# Altium schematic sheet Thermocouple.SchDoc
size Letter
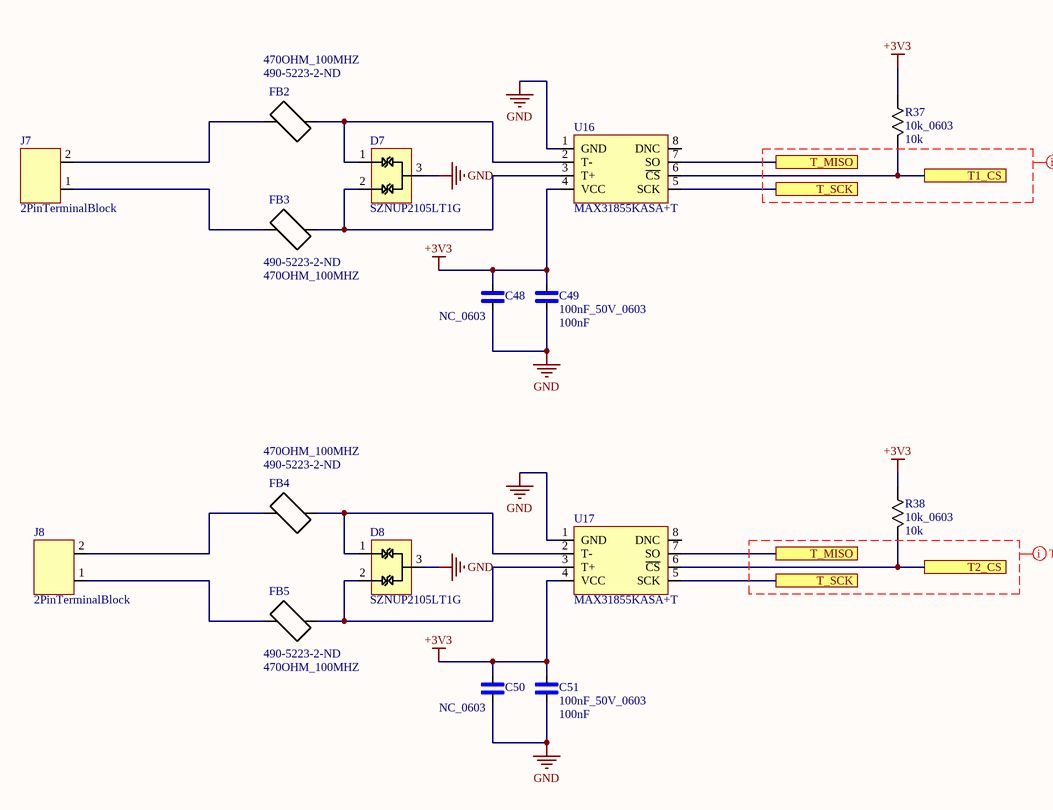
[diagram p0: Thermocouple.SchDoc]

## Parts
C48  NC_0603  [0603]
C49  100nF_50V_0603  Capacitance: 100nF  [0603]
C50  NC_0603  [0603]
C51  100nF_50V_0603  Capacitance: 100nF  [0603]
D7  SZNUP2105LT1G  [SOT-23-3]
D8  SZNUP2105LT1G  [SOT-23-3]
FB2  470OHM_100MHZ  Supplier Part Number 1: 490-5223-2-ND  [0603]
FB3  470OHM_100MHZ  Supplier Part Number 1: 490-5223-2-ND  [0603]
FB4  470OHM_100MHZ  Supplier Part Number 1: 490-5223-2-ND  [0603]
FB5  470OHM_100MHZ  Supplier Part Number 1: 490-5223-2-ND  [0603]
J7  2PinTerminalBlock  [2 Pos 2.54mm Pitch]
J8  2PinTerminalBlock  [2 Pos 2.54mm Pitch]
R37  10k_0603  Resistance: 10k  [0603]
R38  10k_0603  Resistance: 10k  [0603]
U16  MAX31855KASA+T  [MAX31855KASA+T]
U17  MAX31855KASA+T  [MAX31855KASA+T]

## Ports
T1_CS, T2_CS, T_MISO, T_SCK

## Nets
+3V3: C48.2 C49.2 C50.2 C51.2 R37.2 R38.2 U16.4(VCC) U17.4(VCC)
GND: C48.1 C49.1 C50.1 C51.1 D7.3 D8.3 U16.1(GND) U17.1(GND)
T1_CS: R37.1 U16.6(~{CS}) ; port T1_CS
T2_CS: R38.1 U17.6(~{CS}) ; port T2_CS
T_MISO: U16.7(SO) U17.7(SO) ; port T_MISO
T_SCK: U16.5(SCK) U17.5(SCK) ; port T_SCK
NetD7_1: D7.1 FB2.2 U16.2(T-)
NetD7_2: D7.2 FB3.2 U16.3(T+)
NetD8_1: D8.1 FB4.2 U17.2(T-)
NetD8_2: D8.2 FB5.2 U17.3(T+)
NetFB2_1: FB2.1 J7.2
NetFB3_1: FB3.1 J7.1
NetFB4_1: FB4.1 J8.2
NetFB5_1: FB5.1 J8.1

Not connected (* = marked no-connect by the designer): U16 8(DNC); U17 8(DNC)

## Layout directives
net class TCOUPLENETS: (no net found under the mark)

## Library data of the parts
C49 C51 = 100nF_50V_0603: Manufacturer: Murata; Manufacturer Part Number: GRM188R71H104KA93D; Material: Ceramic; Tolerance: 10%; Voltage Rating: 50V; Dielectric: X7R; Insulation Resistance: 10GR; Supplier 1: Digi-Key; Stock 1: 0; Pricing 1: 1=0.12, 10=0.084, 100=0.0396, 500=0.02778, 1000=0.023 (USD); Mount: Surface Mount; Case/Package: 0603; Number of Pins: 2; Case Code (Imperial): 0603; Case Code (Metric): 1608; Dielectric Material: Ceramic; Contact Plating: Tin,Matte; Min Operating Temperature: -55°C; Max Operating Temperature: 125°C; Packaging: Tape and Reel; Voltage Rating (DC): 50V; Package Quantity: 1; Termination: SMD/SMT; Voltage: 50V; Length: 1.6mm; Height: 0.8mm; Width: 0.8mm; Thickness: 0.035inch; Depth: 0.8mm; Radiation Hardening: No; REACH SVHC: No SVHC; Lead Free: Lead Free; ComponentLink1URL: https://datasheet.ciiva.com/19467/1857604-19467681.pdf; ComponentLink1Description: https://datasheet.ciiva.com/19467/1857604-19467681.pdf; ComponentLink2URL: https://datasheet.ciiva.com/28534/4360-28534245.pdf; ComponentLink2Description: https://datasheet.ciiva.com/28534/4360-28534245.pdf; ComponentLink3URL: https://datasheet.ciiva.com/26915/getdatasheetpartid-89095-26915384.pdf; ComponentLink3Description: https://datasheet.ciiva.com/26915/getdatasheetpartid-89095-26915384.pdf; ComponentLink4URL: https://datasheet.ciiva.com/131/partnumbering-e-01-131738.pdf; ComponentLink4Description: https://datasheet.ciiva.com/131/partnumbering-e-01-131738.pdf; ComponentLink5URL: https://datasheet.ciiva.com/7937/1747470-7937658.pdf; ComponentLink5Description: https://datasheet.ciiva.com/7937/1747470-7937658.pdf; ComponentLink6URL: https://datasheet.ciiva.com/14116/nmgrm-data-en-14116602.pdf; ComponentLink6Description: https://datasheet.ciiva.com/14116/nmgrm-data-en-14116602.pdf; ComponentLink7URL: https://datasheet.ciiva.com/131/partnumbering-e-01-131739.pdf; ComponentLink7Description: https://datasheet.ciiva.com/131/partnumbering-e-01-131739.pdf; ComponentLink8URL: https://datasheet.ciiva.com/7937/4360-7937659.pdf; ComponentLink8Description: https://datasheet.ciiva.com/7937/4360-7937659.pdf; ComponentLink9URL: https://datasheet.ciiva.com/48436/nmgrm-data-en-48436667.pdf; ComponentLink9Description: https://datasheet.ciiva.com/48436/nmgrm-data-en-48436667.pdf; ComponentLink10URL: https://datasheet.ciiva.com/131/partnumbering-e-01-131740.pdf; ComponentLink10Description: https://datasheet.ciiva.com/131/partnumbering-e-01-131740.pdf; ComponentLink11URL: https://datasheet.ciiva.com/11786/0900766b807a1cab-11786047.pdf; ComponentLink11Description: https://datasheet.ciiva.com/11786/0900766b807a1cab-11786047.pdf; ComponentLink12URL: https://datasheet.ciiva.com/29201/451744-da-01-en-vs-kondensator-0603-29201904.pdf; ComponentLink12Description: https://datasheet.ciiva.com/29201/451744-da-01-en-vs-kondensator-0603-29201904.pdf; Supplier Part Number 1: 490-1519-6-ND
FB2-FB5 = 470OHM_100MHZ: Manufacturer: Murata; Manufacturer Part Number: BLM18PG471SN1D; Core Material: Ferrite; Material: Steel,Ferrite; Tolerance: 25%; Impedance: 470R; Resistance: 200mR; Current Rating: 1A; Test Frequency: 100MHz; Number of Lines: 1; Supplier 1: Digi-Key; Stock 1: 328000; Pricing 1: 4000=0.02208, 8000=0.02001, 12000=0.01932, 28000=0.01794, 100000=0.01773 (USD); Case/Package: 0603; Number of Pins: 2; Case Code (Metric): 1608; Case Code (Imperial): 0603; Min Operating Temperature: -55°C; Max Operating Temperature: 125°C; Package Quantity: 1; Packaging: Tape and Reel; Max Current Rating: 1A; Max DC Current: 1A; DC Resistance (DCR): 200mR; Termination: SMD/SMT; DC Current: 1A; Military Standard: Not; Number of Circuits: 1; Length: 1.6mm; Height: 0.8mm; Width: 0.8mm; Depth: 0.8mm; Radiation Hardening: No; REACH SVHC: No SVHC; Lead Free: Lead Free; ComponentLink1URL: https://datasheet.ciiva.com/11800/0900766b81275ca5-11800885.pdf; ComponentLink1Description: https://datasheet.ciiva.com/11800/0900766b81275ca5-11800885.pdf; ComponentLink2URL: https://datasheet.ciiva.com/16331/l0110s0100blm18p-16331542.pdf; ComponentLink2Description: https://datasheet.ciiva.com/16331/l0110s0100blm18p-16331542.pdf; ComponentLink3URL: https://datasheet.ciiva.com/8021/1740433-8021497.pdf; ComponentLink3Description: https://datasheet.ciiva.com/8021/1740433-8021497.pdf; ComponentLink4URL: https://datasheet.ciiva.com/6212/l0110s0100blm18p-6212506.pdf; ComponentLink4Description: https://datasheet.ciiva.com/6212/l0110s0100blm18p-6212506.pdf; ComponentLink5URL: https://datasheet.ciiva.com/8021/1740433-8021498.pdf; ComponentLink5Description: https://datasheet.ciiva.com/8021/1740433-8021498.pdf; ComponentLink6URL: https://datasheet.ciiva.com/6212/l0110s0100blm18p-6212508.pdf; ComponentLink6Description: https://datasheet.ciiva.com/6212/l0110s0100blm18p-6212508.pdf; ComponentLink7URL: https://datasheet.ciiva.com/14122/blm-series-eng-tds-14122876.pdf; ComponentLink7Description: https://datasheet.ciiva.com/14122/blm-series-eng-tds-14122876.pdf; ComponentLink8URL: https://datasheet.ciiva.com/6212/l0110s0100blm18p-6212509.pdf; ComponentLink8Description: https://datasheet.ciiva.com/6212/l0110s0100blm18p-6212509.pdf; ComponentLink9URL: https://datasheet.ciiva.com/8508/l0110s0100blm18p-8508303.pdf; ComponentLink9Description: https://datasheet.ciiva.com/8508/l0110s0100blm18p-8508303.pdf
J7 J8 = 2PinTerminalBlock: 2.54mm Terminal Connector
R37 R38 = 10k_0603: Manufacturer: Panasonic; Manufacturer Part Number: ERJ-3EKF1002V; Tolerance: 1%; Max Power Dissipation: 100mW; Temperature Coefficient: 100ppm/°C; Voltage Rating: 75V; Supplier 1: Digi-Key; Stock 1: 0; Pricing 1: 5000=0.00751, 10000=0.00653, 25000=0.00573, 50000=0.00526, 125000=0.00515 (USD); Mount: Surface Mount; Case/Package: 0603; Number of Pins: 2; Case Code (Metric): 1608; Case Code (Imperial): 0603; Contact Plating: Tin; Min Operating Temperature: -55°C; Max Operating Temperature: 155°C; Packaging: Tape and Reel; Power Rating: 100mW; Package Quantity: 1; Termination: SMD/SMT; Composition: Thick Film; Number of Terminations: 2; Military Standard: Not; Voltage Rating (DC): 75V; Length: 1.6mm; Height: 0.45mm; Depth: 0.8mm; Width: 0.031inch; Radiation Hardening: No; Lead Free: Lead Free; REACH SVHC: No SVHC; ComponentLink1URL: https://datasheet.ciiva.com/16511/aoa0000ce2-16511861.pdf; ComponentLink1Description: https://datasheet.ciiva.com/16511/aoa0000ce2-16511861.pdf; ComponentLink2URL: https://datasheet.ciiva.com/46372/1678782-46372725.pdf; ComponentLink2Description: https://datasheet.ciiva.com/46372/1678782-46372725.pdf; ComponentLink3URL: https://datasheet.ciiva.com/28514/426256-28514198.pdf; ComponentLink3Description: https://datasheet.ciiva.com/28514/426256-28514198.pdf; ComponentLink4URL: https://datasheet.ciiva.com/9194/aoa0000ce2-9194199.pdf; ComponentLink4Description: https://datasheet.ciiva.com/9194/aoa0000ce2-9194199.pdf; ComponentLink5URL: https://datasheet.ciiva.com/7830/aoa0000ce2-7830729.pdf; ComponentLink5Description: https://datasheet.ciiva.com/7830/aoa0000ce2-7830729.pdf; ComponentLink6URL: https://datasheet.ciiva.com/17212/aoa0000ce2-17212105.pdf; ComponentLink6Description: https://datasheet.ciiva.com/17212/aoa0000ce2-17212105.pdf; ComponentLink7URL: https://datasheet.ciiva.com/30208/aoa0000ce2-30208985.pdf; ComponentLink7Description: https://datasheet.ciiva.com/30208/aoa0000ce2-30208985.pdf; ComponentLink8URL: https://datasheet.ciiva.com/48530/aoa0000ce2-48530988.pdf; ComponentLink8Description: https://datasheet.ciiva.com/48530/aoa0000ce2-48530988.pdf; ComponentLink9URL: https://datasheet.ciiva.com/24070/aoa0000ce2-24070318.pdf; ComponentLink9Description: https://datasheet.ciiva.com/24070/aoa0000ce2-24070318.pdf; ComponentLink10URL: https://datasheet.ciiva.com/16759/70260748-16759807.pdf; ComponentLink10Description: https://datasheet.ciiva.com/16759/70260748-16759807.pdf; Supplier Part Number 1: P10.0KHTR-ND
U16 U17 = MAX31855KASA+T: K type thermocouple amplifier